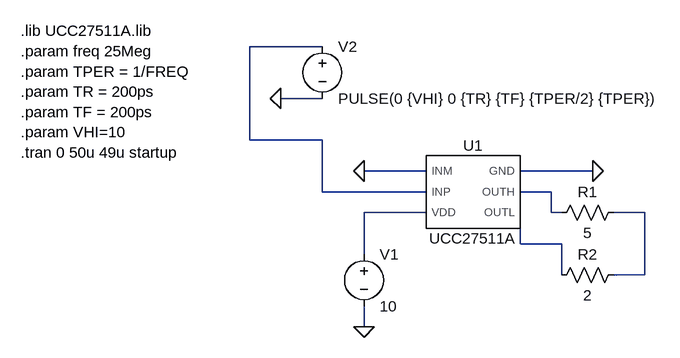
[diagram p0: schematic Driver.asc]
Driver.asc, the LTspice schematic file:
Version 4.1
SHEET 1 880 680
WIRE 240 -48 128 -48
WIRE 240 32 176 32
WIRE 128 96 128 -48
WIRE 240 96 128 96
WIRE 400 144 304 144
WIRE 656 144 544 144
WIRE 240 176 240 96
WIRE 400 176 240 176
WIRE 592 176 544 176
WIRE 400 208 304 208
WIRE 592 208 592 176
WIRE 608 208 592 208
WIRE 736 208 688 208
WIRE 544 256 544 208
WIRE 608 256 544 256
WIRE 304 272 304 208
WIRE 608 304 608 256
WIRE 736 304 736 208
WIRE 736 304 688 304
WIRE 304 384 304 352
FLAG 304 384 0
FLAG 656 144 0
FLAG 304 144 0
FLAG 176 32 0
SYMBOL UCC27511A 464 176 R0
SYMATTR InstName U1
SYMBOL voltage 304 256 R0
SYMATTR InstName V1
SYMATTR Value 10
SYMBOL res 704 192 R90
WINDOW 0 0 56 VBottom 2
WINDOW 3 32 56 VTop 2
SYMATTR InstName R1
SYMATTR Value 5
SYMBOL res 704 288 R90
WINDOW 0 0 56 VBottom 2
WINDOW 3 32 56 VTop 2
SYMATTR InstName R2
SYMATTR Value 2
SYMBOL voltage 240 -64 R0
SYMATTR InstName V2
SYMATTR Value PULSE(0 {VHI} 0 {TR} {TF} {TPER/2} {TPER})
TEXT -224 -72 Left 2 !.lib UCC27511A.lib\n.param freq 25Meg\n.param TPER = 1/FREQ\n.param TR = 200ps\n.param TF = 200ps\n.param VHI=10\n.tran 0 50u 49u startup

The netlist it stands for:
* Driver.asc
X§U1 0 N001 N003 0 N002 N005 UCC27511A  ; pins INM INP VDD GND OUTH OUTL
V1 N003 0 10
R1 N004 N002 5
R2 N004 N005 2
V2 N001 0 PULSE(0 {VHI} 0 {TR} {TF} {TPER/2} {TPER})
.lib UCC27511A.lib
.param freq 25Meg
.param TPER = 1/FREQ
.param TR = 200ps
.param TF = 200ps
.param VHI=10
.tran 0 50u 49u startup
.lib UCC27511A.lib
.backanno
.end